# EAGLE schematic dcdc (EAGLE 9.5.2)
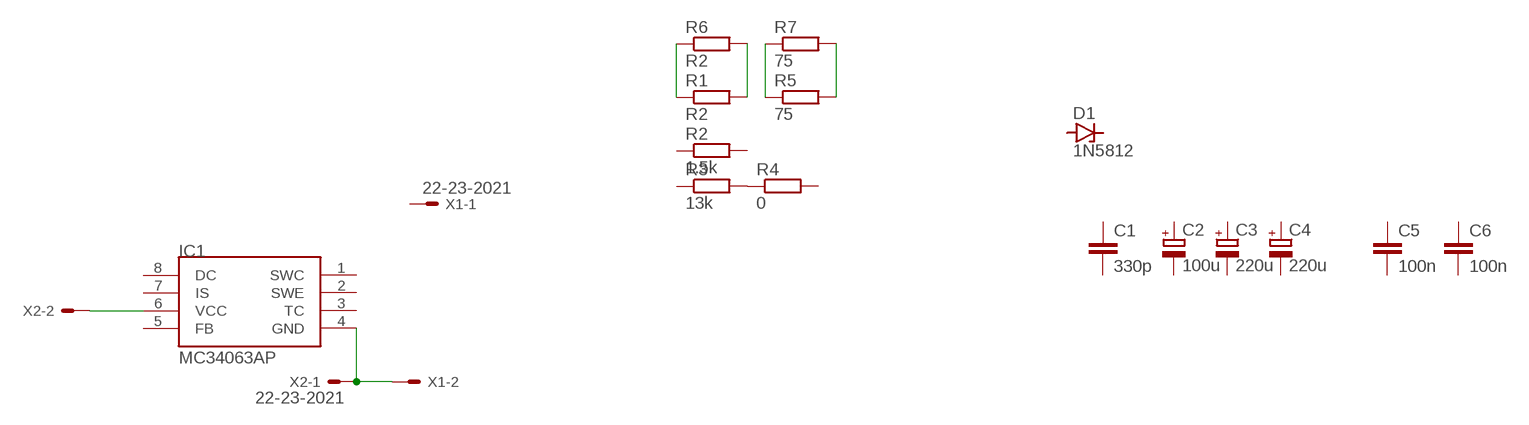
[diagram p0: schematic, sheet 1]

## Parts
C1  330p  C-EUC0805  [C0805]
C2  100u  CPOL-EUE5-10.5  [E5-10,5]
C3  220u  CPOL-EUE5-10.5  [E5-10,5]
C4  220u  CPOL-EUE5-10.5  [E5-10,5]
C5  100n  C-EUC0805  [C0805]
C6  100n  C-EUC0805  [C0805]
D1  1N5812  1N5333  [C1702-15]
IC1  MC34063AP  [DIL08]
R1  R2  R-EU_0207/10  [0207/10]
R2  1.5k  R-EU_R0805  [R0805]
R3  13k  R-EU_R0805  [R0805]
R4  0  R-EU_R0805  [R0805]
R5  75  R-EU_0207/10  [0207/10]
R6  R2  R-EU_R0805  [R0805]
R7  75  R-EU_R0805  [R0805]
X1  22-23-2021  [22-23-2021]
X2  22-23-2021  [22-23-2021]

## Nets
N$1: R3.2 R4.1
N$2: R1.1 R6.1
N$3: R1.2 R6.2
N$4: R5.1 R7.1
N$5: R5.2 R7.2
N$6: IC1.4(GND) X1.2 X2.1
N$7: IC1.6(VCC) X2.2
Unconnected: C1.1 C1.2 C2.+ C2.- C3.+ C3.- C4.+ C4.- C5.1 C5.2 C6.1 C6.2 D1.A D1.C IC1.1(SWC) IC1.2(SWE) IC1.3(TC) IC1.5(FB) IC1.7(IS) IC1.8(DC) R2.1 R2.2 R3.1 R4.2 X1.1

## Library data of the parts
C1 C5 C6 = rcl:C-EU: CAPACITOR, European symbol; SPICEPREFIX: C
C2-C4 = rcl:CPOL-EU: POLARIZED CAPACITOR, European symbol; SPICEPREFIX: C
D1 = diode:1N5333: Z DIODE 3.3 V, 5W, 5 percent (Motorola)
IC1 = mc34063:MC34063
R1-R7 = rcl:R-EU_: RESISTOR, European symbol; SPICEPREFIX: R
X1 X2 = con-molex:22-23-2021: .100" (2.54mm) Center Header - 2 Pin; MF: MOLEX; MPN: 22-23-2021; OC_FARNELL: 1462926; OC_NEWARK: 25C3832